# Altium schematic sheet STM32_Power_Reg.SchDoc
size A4; SheetNumber: 2; SheetTotal: 2
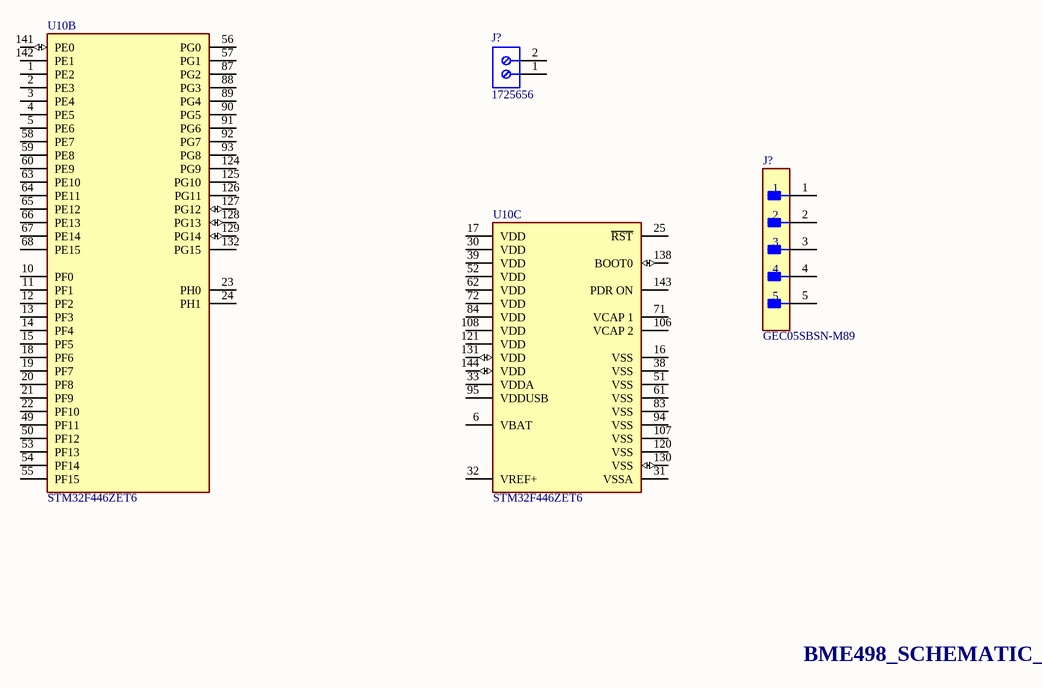
[diagram p0: STM32_Power_Reg.SchDoc]

## Parts
(Parts that share a designator on the sheet are numbered #1, #2 ... from top to bottom, then left to right.)
J?#1  1725656  [PHOE-1725656-2]
J?#2  GEC05SBSN-M89  [FP-GEC05SBSN-M89-MFG]
U10  STM32F446ZET6  [FP-STM32F446ZET6-MFG]  (parts B,C of 3)

## Nets

Not connected (* = marked no-connect by the designer): J?#1 1 2; J?#2 1 2 3 4 5; U10 1(PE2) 2(PE3) 3(PE4) 4(PE5) 5(PE6) 6(VBAT) 10(PF0) 11(PF1) 12(PF2) 13(PF3) 14(PF4) 15(PF5) 16(VSS) 17(VDD) 18(PF6) 19(PF7) 20(PF8) 21(PF9) 22(PF10) 23(PH0) 24(PH1) 25(~{RST}) 30(VDD) 31(VSSA) 32(VREF+) 33(VDDA) 38(VSS) 39(VDD) 49(PF11) 50(PF12) 51(VSS) 52(VDD) 53(PF13) 54(PF14) 55(PF15) 56(PG0) 57(PG1) 58(PE7) 59(PE8) 60(PE9) 61(VSS) 62(VDD) 63(PE10) 64(PE11) 65(PE12) 66(PE13) 67(PE14) 68(PE15) 71(VCAP_1) 72(VDD) 83(VSS) 84(VDD) 87(PG2) 88(PG3) 89(PG4) 90(PG5) 91(PG6) 92(PG7) 93(PG8) 94(VSS) 95(VDDUSB) 106(VCAP_2) 107(VSS) 108(VDD) 120(VSS) 121(VDD) 124(PG9) 125(PG10) 126(PG11) 127(PG12) 128(PG13) 129(PG14) 130(VSS) 131(VDD) 132(PG15) 138(BOOT0) 141(PE0) 142(PE1) 143(PDR_ON) 144(VDD)

## Notes on the sheet
- BME498_SCHEMATIC_B

## Library data of the parts
J?#1 = CMP-2000-05299-1: Male Header, Pitch 2.54 mm, 1 x 2 Position, Height 9 mm, Tail Length 3.5 mm; Manufacturer: Phoenix Contact; Number of contacts: 2; Content: 250pc(s); Pitch: 2.54mm; Industrial packaging: Yes; Colour: Green; Manufacturer part No.: 1725656; Type: MPT0,5/2-2,54; Datasheet URL: http://datasheet.octopart.com/1725656-Phoenix-Contact-datasheet-5302866.pdf; Manufacturer URL: http://www.phoenixcontact.com/; Datasheet Version: Apr-08
J?#2 = CMP-25680-000065-1: CONN HEADER SMD R/A 5POS 2.54MM; Gender: Male; Connector Type: Male Pin; Pitch: 0.1inch; Number of Positions: 5; Package Quantity: 1; Contact Type: Male Pin; Number of Rows: 1; Housing Material: Plastic; Series: -; Housing Color: Black; Termination: Solder; Lead Free: Lead Free; Number of Contacts: 5; Width: 2.54mm; Mount: Surface Mount; Length: 12.7mm; Color: Black; RoHS Compliant: Yes; Height: 3.56mm; Packaging: Bulk; Contact Mating Length: 0.23inch; Contact Plating: Tin; Contact Material: Bronze
U10 = CMP-12105-000067-1: IC MCU 32BIT 512KB FLASH 144LQFP; Manufacturer: STMicroelectronics; Standoff Height: 0.05mm; Memory Size: 512KBytes; Data Bus Width: 32bits; Number Of Timers/Counters: 14; Number Of I2C Channels: 4; Number Of Usb Channels: 2; Frequency: 180MHz; Ram Size: 128KBytes; Number Of I/Os: 114; Min Supply Voltage: 1.7V; Max Junction Temp: +105°C; Number Of Cores: 1; Core Architecture: Arm Cortex-M4; Max Supply Voltage: 3.6V; Number Of Adc Channels: 24; Number Of Pwm Channels: 32; Number Of Uart Channels: 6; Number Of A/D Converters: 3; Interface: I2C,SPI,UART,USART,EBI/EMI,CAN,USB,LIN,IrDA,I2S,SMBus,Other; Mouser Description: 32 Bit Microcontroller, High Performance, Arm Cortex-M4, 180 Mhz, 512 Kb, 128 Kb, 144, Lqfp; Temperature Range High: +105°C; Device Class L3: Microcontrollers; Ambient Temperature Range High: +85°C; Lead Free: Yes; Octopart: https://octopart.com/stm32f446zet6-stmicroelectronics-52642927; Device Class L2: Embedded Processors and Controllers; Height: 1.6mm; Category: IC; Manufacturer Part Number: STM32F446ZET6; RoHS: TRUE; Memory Type: FLASH; Temperature: -40°C to +105°C; Number Of Spi Channels: 4; Device Class L1: Integrated Circuits (ICs); Package: LQFP144; Digikey Description: IC MCU 32BIT 512KB FLASH 144LQFP; Automotive: No; ComponentLink2Description: Datasheet; ComponentLink2URL: https://www.st.com/content/ccc/resource/technical/document/datasheet/65/cb/75/50/53/d6/48/24/DM00141306.pdf/files/DM00141306.pdf/jcr:content/translations/en.DM00141306.pdf; Ambient Temperature Range Low: -40°C; Temperature Range Low: -40°C